# EAGLE design logicboard (EAGLE 9.6.2)
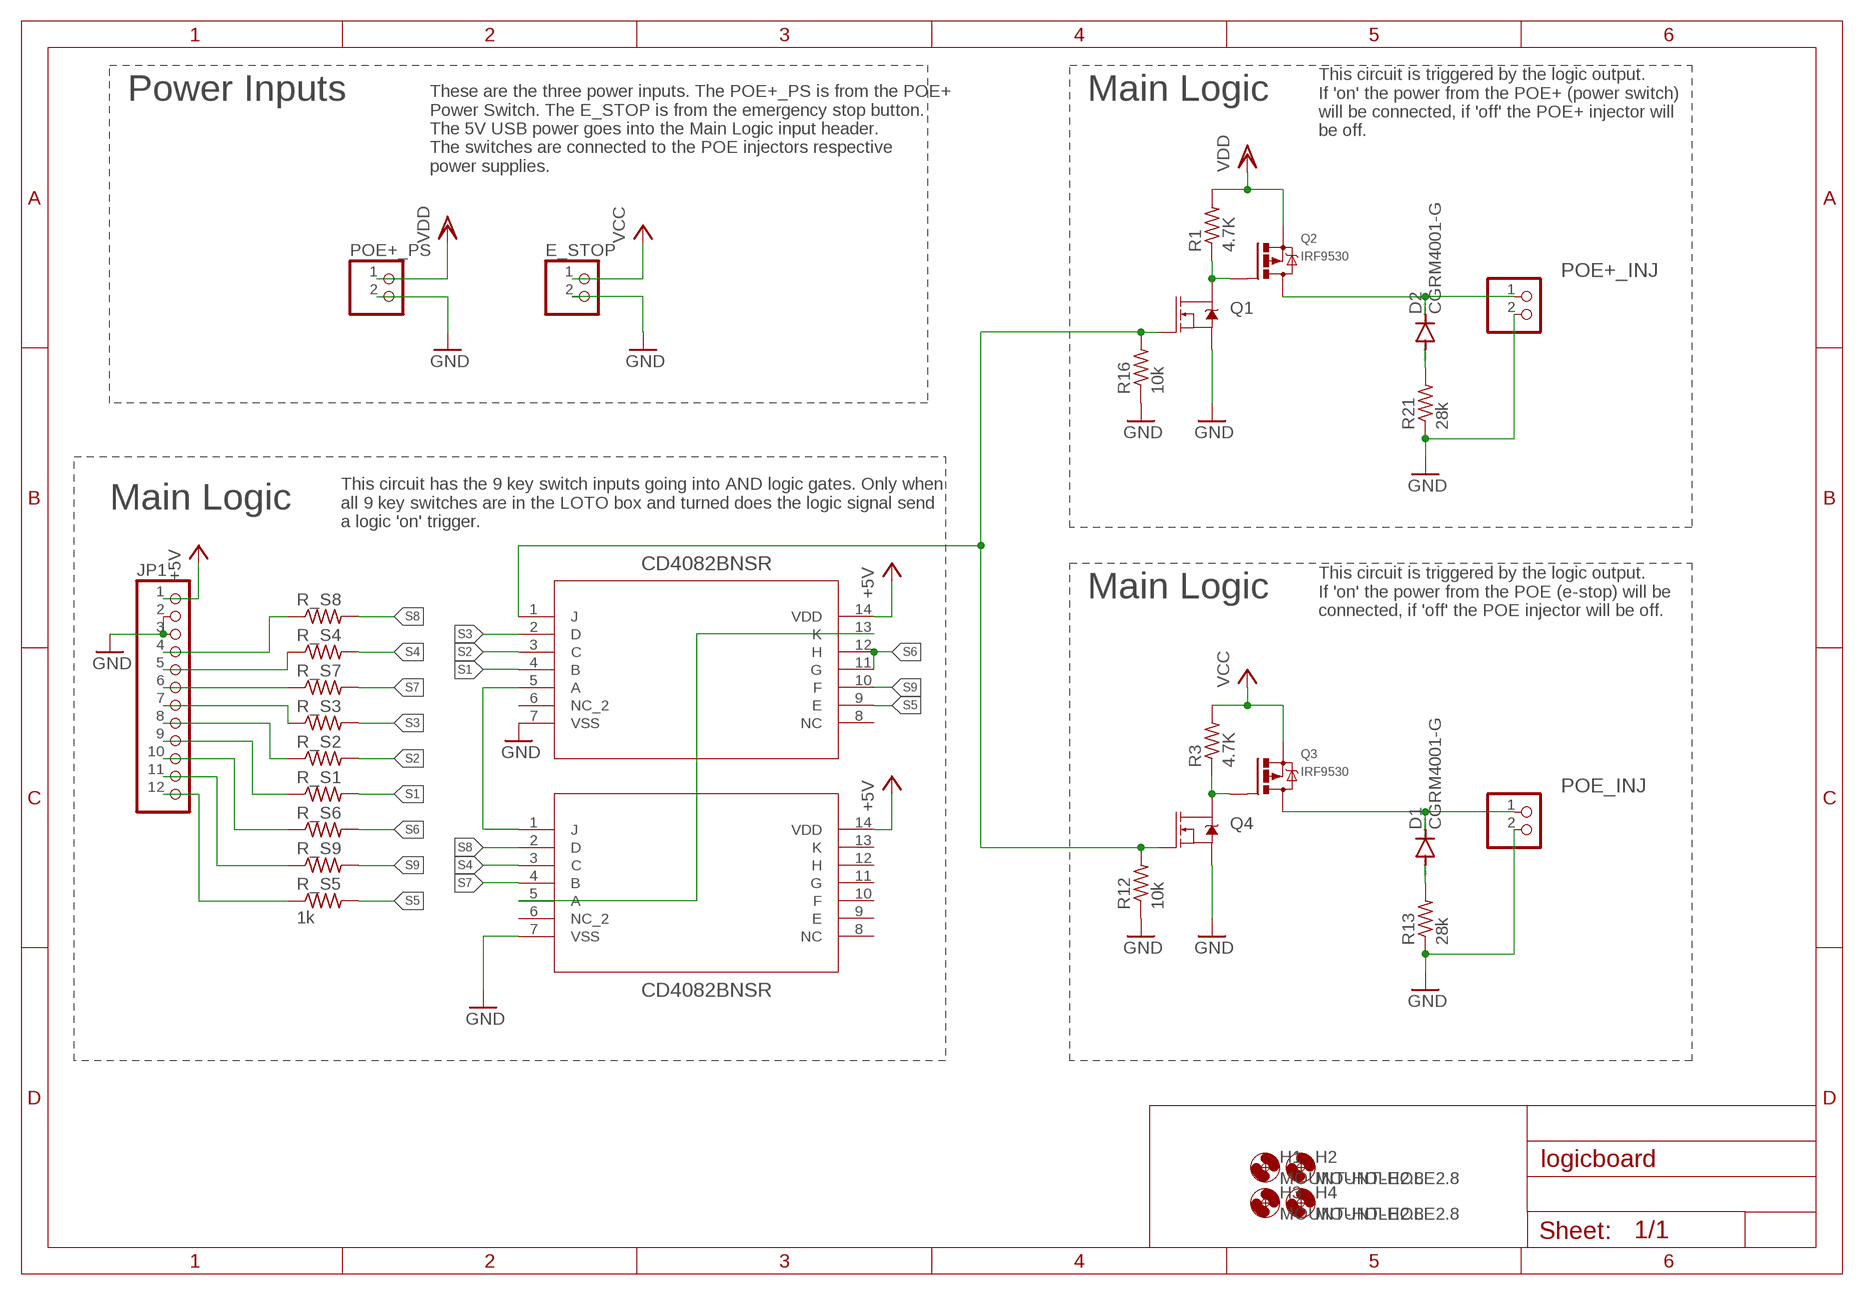
[diagram p0: schematic, sheet 1]

## Parts
D1  CGRM4001-G  [SOD-123_MINI-SMA]
D2  CGRM4001-G  [SOD-123_MINI-SMA]
E_STOP  PINHD-1X2  [1X02]
H1  MOUNT-HOLE2.8  [2,8]
H2  MOUNT-HOLE2.8  [2,8]
H3  MOUNT-HOLE2.8  [2,8]
H4  MOUNT-HOLE2.8  [2,8]
JP1  PINHD-1X12  [1X12]
POE+_INJ  PINHD-1X2  [1X02]
POE+_PS  PINHD-1X2  [1X02]
POE_INJ  PINHD-1X2  [1X02]
Q1  220mA/50V/3.5Ω  MOSFET-NCH-BSS138  [SOT23-3]
Q2  IRF9530  [TO220BV]
Q3  IRF9530  [TO220BV]
Q4  220mA/50V/3.5Ω  MOSFET-NCH-BSS138  [SOT23-3]
R1  4.7K  R-US_0805-C-NOSILK  [.0805-C-NOSILK]
R3  4.7K  R-US_0805-C-NOSILK  [.0805-C-NOSILK]
R12  10k  R-US_0805-C-NOSILK  [.0805-C-NOSILK]
R13  28k  R-US_0805-C-NOSILK  [.0805-C-NOSILK]
R16  10k  R-US_0805-C-NOSILK  [.0805-C-NOSILK]
R21  28k  R-US_0805-C-NOSILK  [.0805-C-NOSILK]
R_S1  1k  R-US_0603-C-NOSILK  [.0603-C-NOSILK]
R_S2  1k  R-US_0603-C-NOSILK  [.0603-C-NOSILK]
R_S3  1k  R-US_0603-C-NOSILK  [.0603-C-NOSILK]
R_S4  1k  R-US_0603-C-NOSILK  [.0603-C-NOSILK]
R_S5  1k  R-US_0603-C-NOSILK  [.0603-C-NOSILK]
R_S6  1k  R-US_0603-C-NOSILK  [.0603-C-NOSILK]
R_S7  1k  R-US_0603-C-NOSILK  [.0603-C-NOSILK]
R_S8  1k  R-US_0603-C-NOSILK  [.0603-C-NOSILK]
R_S9  1k  R-US_0603-C-NOSILK  [.0603-C-NOSILK]
U1  CD4082BNSR  [NS14]
U2  CD4082BNSR  [NS14]

## Nets
+5V: JP1.1 U1.14(VDD) U2.14(VDD)
GND: E_STOP.2 JP1.2 JP1.3 POE+_INJ.2 POE+_PS.2 POE_INJ.2 Q1.2(S) Q4.2(S) R12.1 R13.1 R16.1 R21.1 U1.7(VSS) U2.7(VSS)
N$1: JP1.4 R_S8.1
N$2: JP1.5 R_S4.1
N$3: JP1.6 R_S7.1
N$4: JP1.7 R_S3.1
N$5: JP1.8 R_S2.1
N$6: JP1.9 R_S1.1
N$7: JP1.10 R_S6.1
N$8: JP1.11 R_S9.1
N$9: JP1.12 R_S5.1
N$10: Q1.3(D) Q2.G R1.1
N$20: U1.5(A) U2.1(J)
N$21: U1.13(K) U2.5(A)
N$22: D1.A R13.2
N$23: Q3.G Q4.3(D) R3.1
N$54: D2.A R21.2
ON: Q1.1(G) Q4.1(G) R12.2 R16.2 U1.1(J)
S1: R_S1.2 U1.4(B)
S2: R_S2.2 U1.3(C)
S3: R_S3.2 U1.2(D)
S4: R_S4.2 U2.3(C)
S5: R_S5.2 U1.9(E)
S6: R_S6.2 U1.11(G) U1.12(H)
S7: R_S7.2 U2.4(B)
S8: R_S8.2 U2.2(D)
S9: R_S9.2 U1.10(F)
SOL_GPIO_1: D1.C POE_INJ.1 Q3.D
SOL_GPIO_10: D2.C POE+_INJ.1 Q2.D
VCC: E_STOP.1 Q3.S R3.2
VDD: POE+_PS.1 Q2.S R1.2
Unconnected: U1.6(NC_2) U1.8(NC) U2.6(NC_2) U2.8(NC) U2.9(E) U2.10(F) U2.11(G) U2.12(H) U2.13(K)

## Notes on the sheet
- Power Inputs | Main Logic
- This circuit is triggered by the logic output. 
  If 'on' the power from the POE+ (power switch) 
  will be connected, if 'off' the POE+ injector will 
  be off.
- These are the three power inputs. The POE+_PS is from the POE+ 
  Power Switch. The E_STOP is from the emergency stop button. 
  The 5V USB power goes into the Main Logic input header.
  The switches are connected to the POE injectors respective 
  power supplies.
- Main Logic
- This circuit has the 9 key switch inputs going into AND logic gates. Only when 
  all 9 key switches are in the LOTO box and turned does the logic signal send 
  a logic 'on' trigger.
- Main Logic
- This circuit is triggered by the logic output. 
  If 'on' the power from the POE (e-stop) will be 
  connected, if 'off' the POE injector will be off.

## Library data of the parts
D1 D2 = diode:CGRM400*-G: Molded plasitc,JEDEC SOD-123/Mini SMA Source: Comchip CGRM4001-G.pdf; DIS: Digi-Key; DPN: 1514-CMHSH5-4TRPBFREECT-ND; MFR: Central Semiconductor Corp; MPN: CMHSH5-4 TR PBFREE
E_STOP POE+_PS = pinhead:PINHD-1X2: PIN HEADER; DIS: Digi-Key; DPN: ED10561-ND; MFR: On Shore Technology Inc.; MPN: OSTVN02A150
H1-H4 = holes:MOUNT-HOLE: MOUNTING HOLE with drill center marker
JP1 = pinhead:PINHD-1X12: PIN HEADER; DIS: Digi-Key; DPN: A19439-ND; MFR: TE Connectivity AMP Connectors; MPN: 1-640454-2
POE+_INJ POE_INJ = pinhead:PINHD-1X2: PIN HEADER; DIS: Digi-Key; DPN: 900-0022232021-ND; MFR: Molex; MPN: 0022232021
Q1 Q4 = SparkFun-DiscreteSemi:MOSFET-NCH: N-channel MOSFETs Voltage controlled devices that allow control of high current outputs. SparkFun Products: SparkFun OpenScale <https://www.sparkfun.com/products/13261> SparkFun Digital Sandbox <https://www.sparkfun.com/products/12651> SparkFun Monster Moto Shield <https://www.sparkfun.com/products/10182> SparkFun MOSFET Power Controller <https://www.sparkfun.com/products/11214>; DIS: Digi-Key; DPN: 1727-1142-1-ND; MFR: Nexperia USA Inc.; MPN: BSS138P,215; PROD_ID: TRANS-00830
Q2 Q3 = transistor-power:IRF9530: P-CHANNEL HEXFET POWER-MOS-FET Source: http://www.irf.com/product-info/datasheets/data/irf9530.pdf; DIS: Digi-Key; DPN: IRF9530NPBF-ND; MFR: Infineon Technologies; MPN: IRF9530NPBF
R1 R3 = oresat-rcl:R-US_: RESISTOR, American symbol; DIS: Digi-Key; DPN: 311-4.70KCRCT-ND; MFR: Yageo; MPN: RC0805FR-074K7L
R12 R16 = oresat-rcl:R-US_: RESISTOR, American symbol; DIS: Digi-Key; DPN: 311-10.0KCRCT-ND; MFR: Yageo; MPN: RC0805FR-0710KL
R13 R21 = oresat-rcl:R-US_: RESISTOR, American symbol; DIS: Digi-Key; DPN: RMCF0805FT28K0CT-ND; MFR: Stackpole Electronics Inc; MPN: RMCF0805FT28K0
R_S1-R_S9 = oresat-rcl:R-US_: RESISTOR, American symbol; DIS: Digi-Key; DPN: P1.0KBYCT-ND; MFR: Panasonic Electronic Components; MPN: ERJ-PA3F1001V
U1 U2 = CD4082BNSR:CD4082BNSR; DATASHEET_URL: http://www.ti.com/lit/gpn/CD4082B; DESCRIPTION: CMOS Dual 4-Input AND Gate; DIS: Digi-Key; DPN: 296-31524-1-ND; FAMILY_NAME: AND GATE; GENERIC_PART_NUMBER: CD4082B; INDUSTRY_STD_PKG_TYPE: SO; MANUFACTURER: Texas Instruments; MFR: Texas Instruments; MPN: CD4082BNSR; PACKAGE_DESIGNATOR: NS; PIN_COUNT: 14

## Board
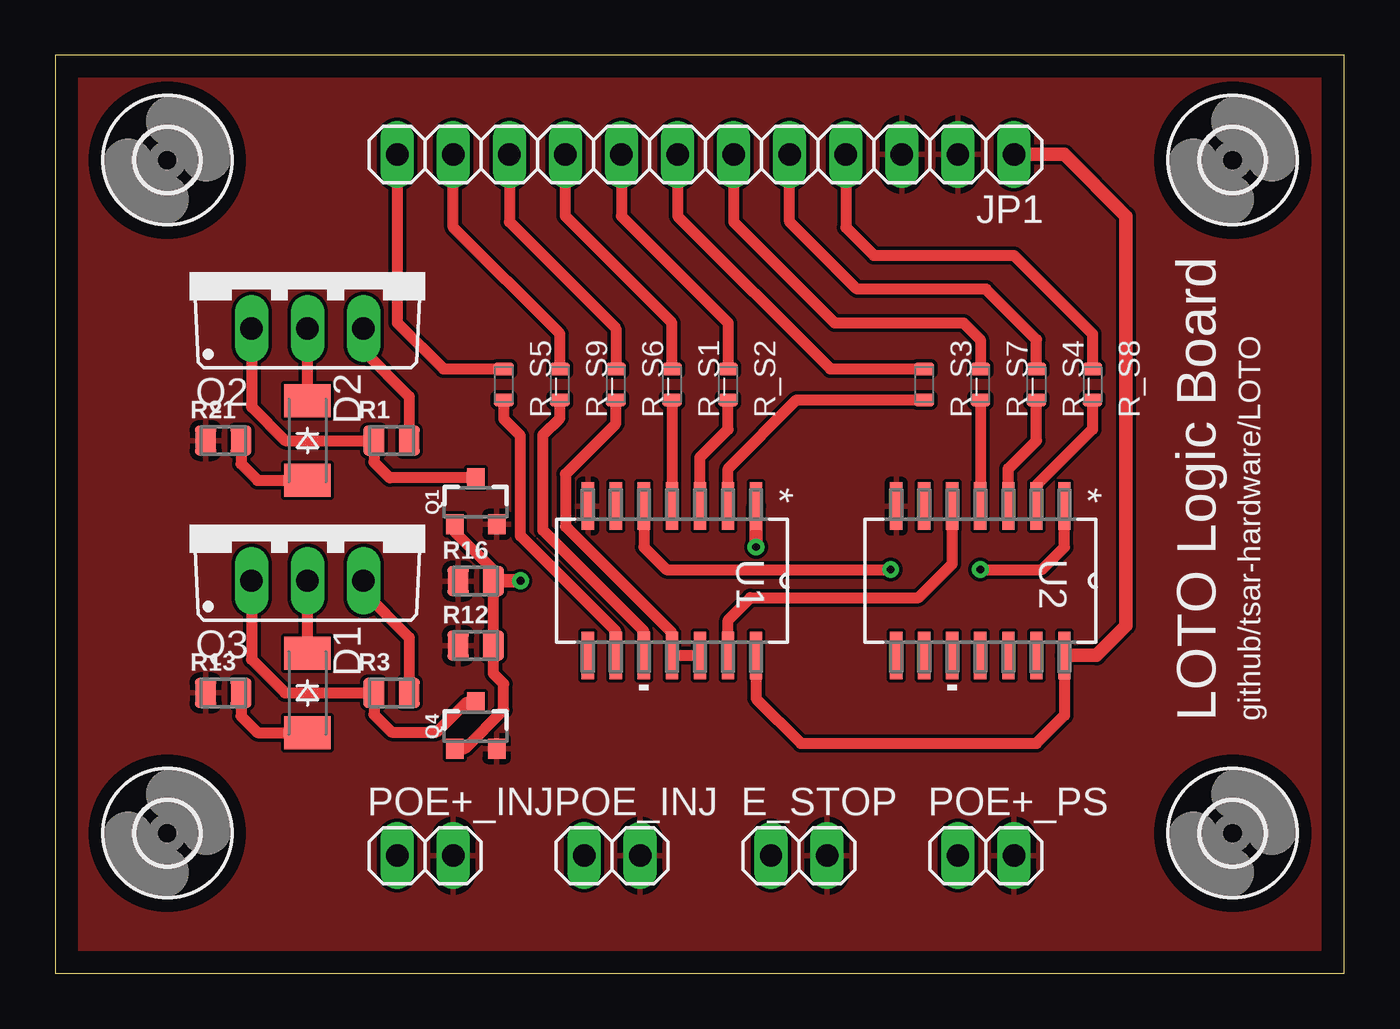
[diagram p1: board, top side]
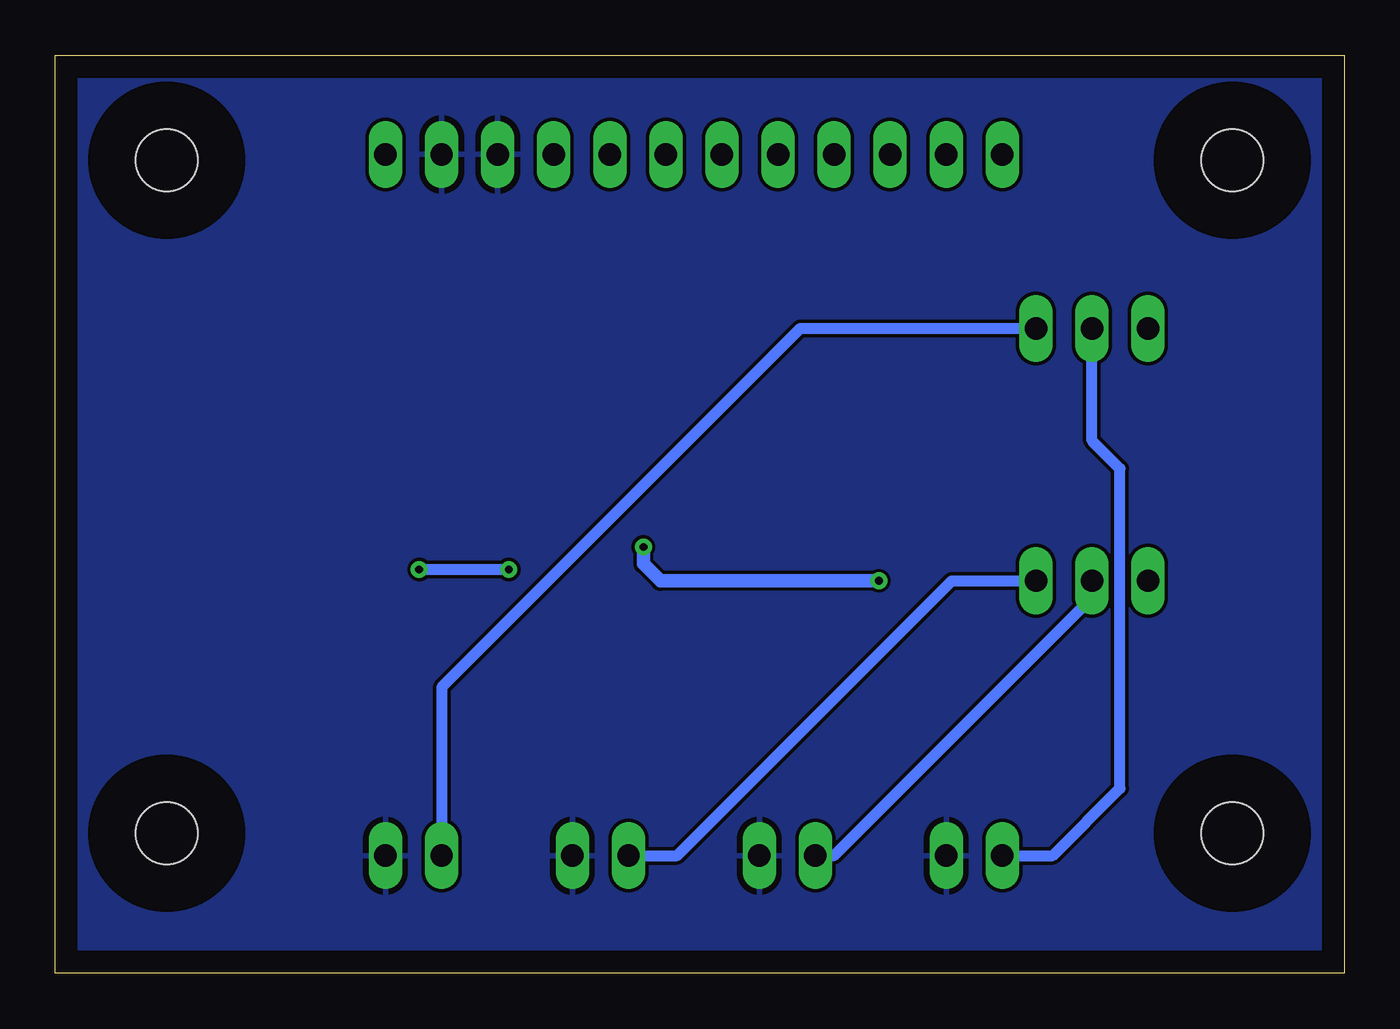
[diagram p2: board, bottom side, seen from below]

Size 58.4 x 41.58 mm. Coordinates in mm from the lower left corner, seen from the top.
Outline: 0,0 58.4,0 58.4,41.58 0,41.58 0,0
Copper layers (1*16): Top 0.035mm / dielectric 1.5mm / Bottom 0.035mm
Design rules "default": minimum track width 6mil, minimum drill 0.35mm, track to track 6mil, track to pad 6mil, pad to pad 6mil, via to via 6mil, smd to smd 6mil, copper to edge 40mil, drill to drill 6mil, minimum pad ring 10mil, minimum via ring 8mil, stop-mask expansion 4mil, vias tented up to drill 0mil, thermal gap 10mil

### Footprints (pad centres in the part's own frame; a part is rotated, then mirrored left to right if it is on the bottom)
SOD-123_MINI-SMA = smd 1.5 x 2.1: A 1.8,0; C -1.8,0
1X02 = drill 1.016 long: 1 -1.27,0; 2 1.27,0
2,8 = hole 2.8: 0,0
1X12 = drill 1.016 long: 1 -13.97,0; 2 -11.43,0; 3 -8.89,0; 4 -6.35,0; 5 -3.81,0; 6 -1.27,0; 7 1.27,0; 8 3.81,0; 9 6.35,0; 10 8.89,0; 11 11.43,0; 12 13.97,0
SOT23-3 = smd 0.8 x 0.9: 1 -0.95,-1; 2 0.95,-1; 3 0,1.1
TO220BV = drill 1.016 long: D 0,-2.54; G -2.54,-2.54; S 2.54,-2.54
.0805-C-NOSILK = smd 0.95 x 1.35: 1 -0.8,0; 2 0.8,0
.0603-C-NOSILK = smd 0.6 x 0.9: 1 -0.7,0; 2 0.7,0
NS14 = smd 2.159 x 0.559: 1 -3.378,3.81; 2 -3.378,2.54; 3 -3.378,1.27; 4 -3.378,0; 5 -3.378,-1.27; 6 -3.378,-2.54; 7 -3.378,-3.81; 8 3.378,-3.81; 9 3.378,-2.54; 10 3.378,-1.27; 11 3.378,0; 12 3.378,1.27; 13 3.378,2.54; 14 3.378,3.81

### Placement (x,y rotation side)
D1  11.43,12.7 270 top
D2  11.43,24.13 270 top
E_STOP  33.7,5.33 0 top
H1  5.08,6.35 0 top
H2  53.34,6.35 0 top
H3  5.08,36.83 0 top
H4  53.34,36.83 0 top
JP1  29.46,37.08 180 top
POE+_INJ  16.76,5.33 0 top
POE+_PS  42.16,5.33 0 top
POE_INJ  25.23,5.33 0 top
Q1  19.05,21.34 0 top
Q2  11.43,31.75 0 top
Q3  11.43,20.32 0 top
Q4  19.05,11.18 0 top
R1  15.24,24.13 0 top
R3  15.24,12.7 0 top
R12  19.05,14.85 0 top
R13  7.62,12.7 0 top
R16  19.05,17.77 0 top
R21  7.62,24.13 0 top
R_S1  27.94,26.67 270 top
R_S2  30.48,26.67 270 top
R_S3  39.37,26.67 270 top
R_S4  44.45,26.67 270 top
R_S5  20.32,26.67 270 top
R_S6  25.4,26.67 270 top
R_S7  41.91,26.67 270 top
R_S8  46.99,26.67 270 top
R_S9  22.86,26.67 270 top
U1  27.94,17.78 270 top
U2  41.91,17.78 270 top

### Tracks (layer width: path | path; a pad name or v marks a point on that pad's centre or on a via)
+5V
  Top 0.508: U1.14 31.75,12.45 33.78,10.41 44.45,10.41 45.72,11.68 U2.14
  Top 0.61: JP1.1 45.72,37.08 48.51,34.29 48.51,15.75 47.17,14.4 U2.14
GND
  pour Bottom: 0,41.66 58.42,41.66 58.42,39.62 58.42,0 56.64,0 0,0 0,2.03
  pour Top: 0,41.66 58.42,41.66 58.42,39.37 58.42,0 55.63,0 0,0 0,1.27
N$1
  Top 0.508: R_S8.1 46.99,28.96 43.43,32.51 37.08,32.51 35.81,33.78 JP1.4
N$2
  Top 0.508: R_S4.1 44.45,28.7 42.16,30.99 36.32,30.99 33.27,34.04 JP1.5
N$3
  Top 0.508: JP1.6 30.73,34.04 35.31,29.46 41.15,29.46 41.91,28.7 R_S7.1
N$4
  Top 0.508: JP1.7 28.19,34.29 35.11,27.37 R_S3.1
N$5
  Top 0.508: JP1.8 25.65,34.29 30.48,29.46 R_S2.1
N$6
  Top 0.508: R_S1.1 27.94,29.46 23.11,34.29 JP1.9
N$7
  Top 0.508: R_S6.1 25.4,29.21 20.57,34.04 JP1.10
N$8
  Top 0.508: R_S9.1 22.86,28.96 18.03,33.78 JP1.11
N$9
  Top 0.508: JP1.12 15.49,29.46 17.59,27.37 R_S5.1
N$10
  Top 0.508: Q2.G 8.89,25.65 10.41,24.13 R1.1 14.44,23.15 15.16,22.44 Q1.3
N$20  (via drill 0.35)
  Top 0.508: U1.5 26.67,19.3 27.69,18.29 v37.85,18.29 | U2.1 45.72,19.3 44.7,18.29 v41.91,18.29
  Bottom 0.508: v37.85,18.29 v41.91,18.29
N$21
  Top 0.508: U1.13 30.48,16 31.5,17.02 39.12,17.02 40.64,18.54 U2.5
N$22
  Top 0.508: R13.2 8.42,11.65 9.17,10.9 D1.A
N$23
  Top 0.508: Q3.G 8.89,14.22 10.41,12.7 R3.1 14.44,11.72 15.24,10.92 17.27,10.92 18.63,12.28 Q4.3
N$54
  Top 0.508: R21.2 8.42,23.08 9.17,22.33 D2.A
ON  (via drill 0.35)
  Top 0.508: Q1.1 18.1,20 19.85,18.25 R16.2 R12.2 19.85,13.58 20.32,13.11 20.32,11.94 18.56,10.18 Q4.1
  Top 0.61: R16.2 19.86,17.78 v21.08,17.78 | v31.75,19.3 U1.1
  Bottom 0.61: v21.08,17.78 30.99,17.78 31.75,18.54 v31.75,19.3
S1
  Top 0.508: R_S1.2 U1.4
S2
  Top 0.508: U1.3 29.21,23.37 30.48,24.64 R_S2.2
S3
  Top 0.508: U1.2 30.48,22.86 33.59,25.97 R_S3.2
S4
  Top 0.508: U2.3 43.18,22.86 44.45,24.13 R_S4.2
S5
  Top 0.508: R_S5.2 20.32,25.11 21.08,24.35 21.08,19.81 25.4,15.49 U1.9
S6
  Top 0.508: U1.12 U1.11 27.94,15.41 23.11,20.24 23.11,22.61 25.4,24.89 R_S6.2
S7
  Top 0.508: R_S7.2 U2.4
S8
  Top 0.508: U2.2 44.45,22.1 46.99,24.64 R_S8.2
S9
  Top 0.508: U1.10 26.67,15.49 22.1,20.07 22.1,24.38 22.86,25.15 R_S9.2
SOL_GPIO_1
  Top 0.508: D1.C Q3.D
  Bottom 0.508: Q3.D 11.43,17.02 23.11,5.33 POE_INJ.1
SOL_GPIO_10
  Top 0.508: D2.C Q2.D
  Bottom 0.508: POE+_INJ.1 13.21,5.33 10.16,8.38 10.16,22.86 11.43,24.13 Q2.D
VCC
  Top 0.508: Q3.S 13.97,17.27 16.04,15.2 R3.2
  Bottom 0.508: Q3.S 17.78,17.78 30.23,5.33 E_STOP.1
VDD
  Top 0.508: Q2.S 13.97,28.19 16.04,26.12 R1.2
  Bottom 0.508: POE+_PS.1 40.89,12.95 24.64,29.21 Q2.S

### Text on the board
tNames: LOTO Logic Board | github/tsar-hardware/LOTO